# EAGLE schematic KE3IJ-SuperRegen-FM-receiver (EAGLE 5.07)
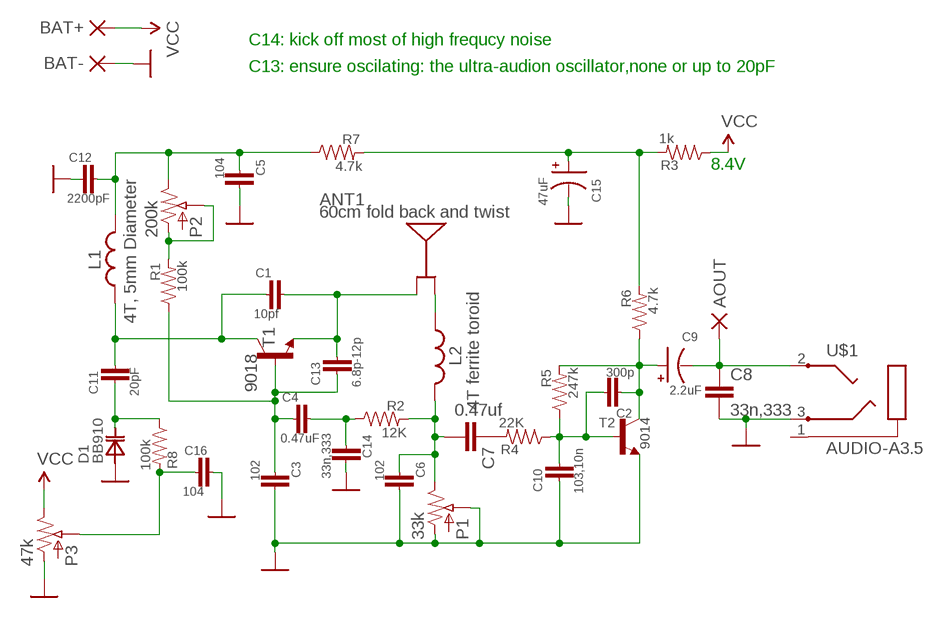
[diagram p0: schematic, sheet 1]

## Parts
ANT1  60cm fold back and twist  ANT-TWIST  [ANT-WISP-2PAD]
AOUT  PAD-SMD20S  [SMD20S]
BAT+  PAD-SMD20S  [SMD20S]
BAT-  PAD-SMD20S  [SMD20S]
C1  10pf  CAP-RF  [CAP-SMD-SMALL]
C2  300p  CAP-RF  [CAP-SMD-SMALL]
C3  102  CAP-RF  [CAP-SMD-SMALL]
C4  0.47uF  CAP-C0805  [C0805]
C5  104  CAP-RF  [CAP-SMD-SMALL]
C6  102  CAP-RF  [CAP-SMD-SMALL]
C7  0.47uf  CAP0805  [0805]
C8  33n,333  CAP0805  [0805]
C9  2.2uF  CAP_POL-RF  [CPOL-SMD-10UF-25V]
C10  103,10n  CAP-RF  [CAP-SMD-SMALL]
C11  20pF  CAP-C0805  [C0805]
C12  2200pF  CAP-RF  [CAP-SMD-SMALL]
C13  6.8p-12p  CAP-RF  [CAP-SMD-SMALL]
C14  33n,333  CAP-RF  [CAP-SMD-SMALL]
C15  47uF  CAP_POL-CT6032  [CT6032]
C16  104  CAP-RF  [CAP-SMD-SMALL]
D1  BB910  VC-DIODE2.5  [D-2,5]
L1  4T, 5mm Diameter  COILAIRCOIL2.54  [2.54CM-U-COIL]
L2  4T ferrite toroid  COILAIRCOIL2.54  [2.54CM-U-COIL]
P1  33k  POTB25P-3362P  [B25P]
P2  200k  POTB25P-3362P  [B25P]
P3  47k  POTB25P-3362P  [B25P]
R1  100k  RESISTOR1/4W-RF  [AXIAL-0.3-SMD]
R2  12K  RESISTOR0805  [0805]
R3  1k  RESISTOR1/4W-RF  [AXIAL-0.3-SMD]
R4  22K  RESISTOR0805  [0805]
R5  247k  RESISTOR1/4W-RF  [AXIAL-0.3-SMD]
R6  4.7k  RESISTOR1/4W-RF  [AXIAL-0.3-SMD]
R7  4.7k  RESISTOR0805  [0805]
R8  100k  RESISTOR1/4W-RF  [AXIAL-0.3-SMD]
T1  9018  -NPN-TO92-EBC-SMD-MIRROR  [TO92-EBC-SMD-MIRROR]
T2  9014  -NPN-TO92-EBC-SMD-MIRROR  [TO92-EBC-SMD-MIRROR]
U$1  AUDIO-A3.5  AUDIO-JACK-MINI-A3.5  [MIN-AUDIO-3.5MM]

## Nets
GND: BAT-.PAD(P) C3.P$1 C5.P$1 C6.P$1 C8.2 C10.P$2 C12.P$2 C14.P$1 C15.- C16.P$1 D1.A P1.A P1.S P3.A T2.E U$1.3(RING)
N$1: C1.P$2 C11.1 L1.P$3 T1.C
N$2: C2.P$1 C10.P$1 R4.1 R5.P$1 T2.B
N$3: ANT1.P$3(S2) C1.P$1 C13.P$1 T1.E
N$4: C3.P$2 C4.2 C13.P$2 R1.P$1 T1.B
N$5: C4.1 C14.P$2 R2.1
N$6: C6.P$2 C7.2 L2.P$4 P1.E R2.2
N$7: C7.1 R4.2
N$8: AOUT.PAD(P) C8.1 C9.- U$1.2(TIP)
N$9: C2.P$2 C9.+ R5.P$2 R6.P$1 T2.C
N$10: ANT1.P$4(S1) L2.P$3
N$11: C5.P$2 C12.P$1 L1.P$4 P2.E R7.1
N$12: C11.2 D1.K R8.P$1
N$13: P2.A P2.S R1.P$2
N$14: C16.P$2 P3.S R8.P$2
N$15: C15.+ R3.P$2 R6.P$2 R7.2
VCC: BAT+.PAD(P) P3.E R3.P$1
Unconnected: U$1.1(EARTH)

## Notes on the sheet
- C14: kick off most of high frequcy noise
- C13: ensure oscilating: the ultra-audion oscillator,none or up to 20pF
- 8.4V

## Library data of the parts
ANT1 = dtoy-RF:ANT-TWIST
AOUT BAT+ BAT- = dpads:PAD: WIRE PAD Standard US Drill Sizes and SMD pads
C1-C6 C10-C14 C16 = digital-toy:CAP: Capacitor Standard 0603 ceramic capacitor, and 0.1" leaded capacitor.
C7 C8 = SparkFun:CAP: Capacitor Standard 0603 ceramic capacitor, and 0.1" leaded capacitor.
C9 C15 = digital-toy:CAP_POL: Capacitor Polarized These are standard SMD and PTH capacitors. Normally 10uF, 47uF, and 100uF in electrolytic and tantalum varieties. Always verify the external diameter of the through hole cap, it varies with capacity, voltage, and manufacturer. The EIA devices should be standard. PANASONIC_D size: 6.5mmx6.5mmx5.5mm, 100uf (taobao:6.3mmx5.5mm), same as CVL0605 153cvl0405 size: 4mmx4mmx5.5mm, 10uf (taobao:4mmx5.5mm) ct6032 typical 47uF Tantalum, comment by hyl.
D1 = dtoy-RF:VC-DIODE: cap diode 2011,4.6 dtoy by hyl
L1 L2 = dtoy-RF:COIL
P1-P3 = digital-toy:POT: POT digital toy POT, 3296 multi turn, blue-white ... hyl 8/07/2001
R1-R8 = digital-toy:RESISTOR: Resistor Basic schematic elements and footprints for 0603, 1206, and PTH 1/10th watt (small) resistors. digital-toy copy vertical mount of axial-0.3 from rcl.lbr : the 0207/xx 3W resistor: 0617/17, 0617/22, 0617V
T1 T2 = digital-toy:*-NPN-: NPN Transistror most of sot-23 use the pacages sot23-BEC, top C, left B, right E. by hyl, digital-toy. and to-92 use ebc(from-top) by hyl, digital-toy.
U$1 = digital-toy:AUDIO-JACK: 2.5 Stereo Audio Jack (SMT)